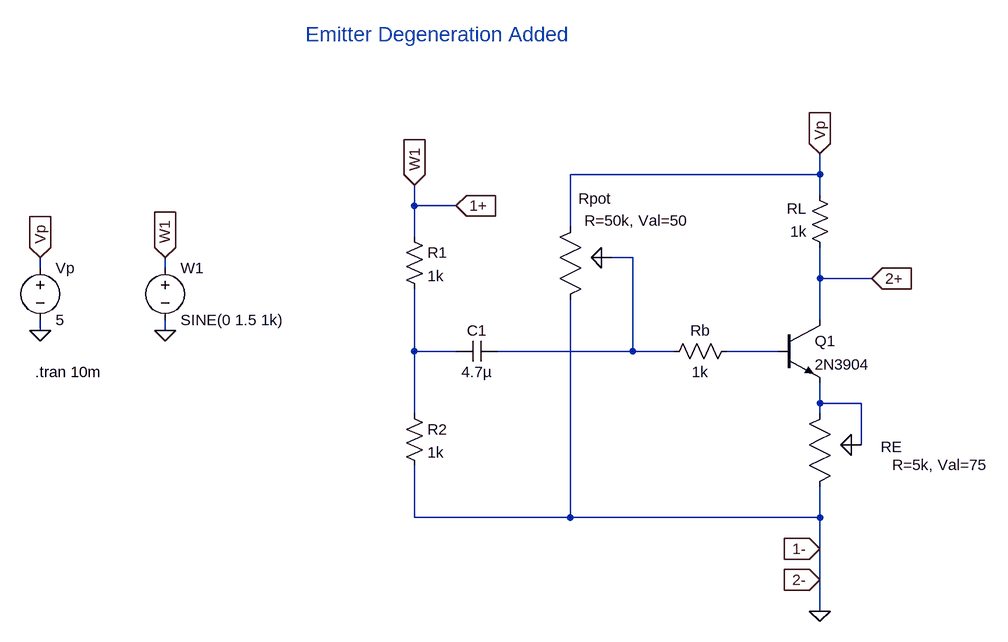
[diagram p0: schematic emitter_degeneration_added.asc]
emitter_degeneration_added.asc, the LTspice schematic file:
Version 4
SHEET 1 1572 952
WIRE 1312 256 1312 224
WIRE 1312 256 928 256
WIRE 1312 288 1312 256
WIRE 688 304 688 272
WIRE 752 304 688 304
WIRE 928 336 928 256
WIRE 688 352 688 304
WIRE 1024 384 992 384
WIRE 112 400 112 384
WIRE 304 400 304 384
WIRE 1312 416 1312 368
WIRE 1392 416 1312 416
WIRE 1312 480 1312 416
WIRE 112 496 112 480
WIRE 304 496 304 480
WIRE 688 528 688 432
WIRE 752 528 688 528
WIRE 1024 528 1024 384
WIRE 1024 528 816 528
WIRE 1088 528 1024 528
WIRE 1248 528 1168 528
WIRE 1312 608 1312 576
WIRE 1376 608 1312 608
WIRE 688 624 688 528
WIRE 1312 624 1312 608
WIRE 1376 672 1376 608
WIRE 688 784 688 704
WIRE 928 784 928 448
WIRE 928 784 688 784
WIRE 1312 784 1312 736
WIRE 1312 784 928 784
WIRE 1312 832 1312 784
WIRE 1312 880 1312 832
WIRE 1312 928 1312 880
FLAG 1312 928 0
FLAG 1312 224 Vp
IOPIN 1312 224 In
FLAG 688 272 W1
IOPIN 688 272 In
FLAG 752 304 1+
IOPIN 752 304 In
FLAG 1392 416 2+
IOPIN 1392 416 In
FLAG 1312 880 2-
IOPIN 1312 880 In
FLAG 112 496 0
FLAG 304 496 0
FLAG 112 384 Vp
IOPIN 112 384 In
FLAG 304 384 W1
IOPIN 304 384 In
FLAG 1312 832 1-
IOPIN 1312 832 In
SYMBOL res 672 336 R0
SYMATTR InstName R1
SYMATTR Value 1k
SYMBOL res 672 608 R0
SYMATTR InstName R2
SYMATTR Value 1k
SYMBOL res 1184 512 R90
WINDOW 0 0 56 VBottom 2
WINDOW 3 32 56 VTop 2
SYMATTR InstName Rb
SYMATTR Value 1k
SYMBOL res 1328 384 R180
WINDOW 0 36 76 Left 2
WINDOW 3 36 40 Left 2
SYMATTR InstName RL
SYMATTR Value 1k
SYMBOL potentiometer 944 352 M0
WINDOW 0 -47 -59 Left 2
WINDOW 39 -165 -25 Left 2
SYMATTR InstName Rpot
SYMBOL npn 1248 480 R0
SYMATTR InstName Q1
SYMATTR Value 2N3904
SYMBOL cap 816 512 R90
WINDOW 0 0 32 VBottom 2
WINDOW 3 32 32 VTop 2
SYMATTR InstName C1
SYMATTR Value 4.7µ
SYMBOL voltage 304 384 R0
WINDOW 123 0 0 Left 0
WINDOW 39 0 0 Left 0
SYMATTR InstName W1
SYMATTR Value SINE(0 1.5 1k)
SYMBOL voltage 112 384 R0
WINDOW 123 0 0 Left 0
WINDOW 39 0 0 Left 0
SYMATTR InstName Vp
SYMATTR Value 5
SYMBOL potentiometer 1328 640 M0
WINDOW 0 -111 35 Left 2
WINDOW 39 -242 63 Left 2
SYMATTR InstName RE
SYMATTR SpiceLine R=5k, Val=75
TEXT 520 40 Left 3 ;Emitter Degeneration Added
TEXT 104 560 Left 2 !.tran 10m

The netlist it stands for:
* emitter_degeneration_added.asc
R1 1+ N002 1k
R2 N002 0 1k
Rb N003 N001 1k
RL 2+ Vp 1k
XRpot Vp N001 0 potentiometer R=50k, Val=50  ; pins 1 2 3
Q1 2+ N003 N004 0 2N3904
C1 N001 N002 4.7µ
V§W1 1+ 0 SINE(0 1.5 1k)
Vp Vp 0 5
XRE N004 N004 0 potentiometer R=5k, Val=75  ; pins 1 2 3
.model NPN NPN
.model PNP PNP
.lib standard.bjt
* Emitter Degeneration Added
.tran 10m
.backanno
.end